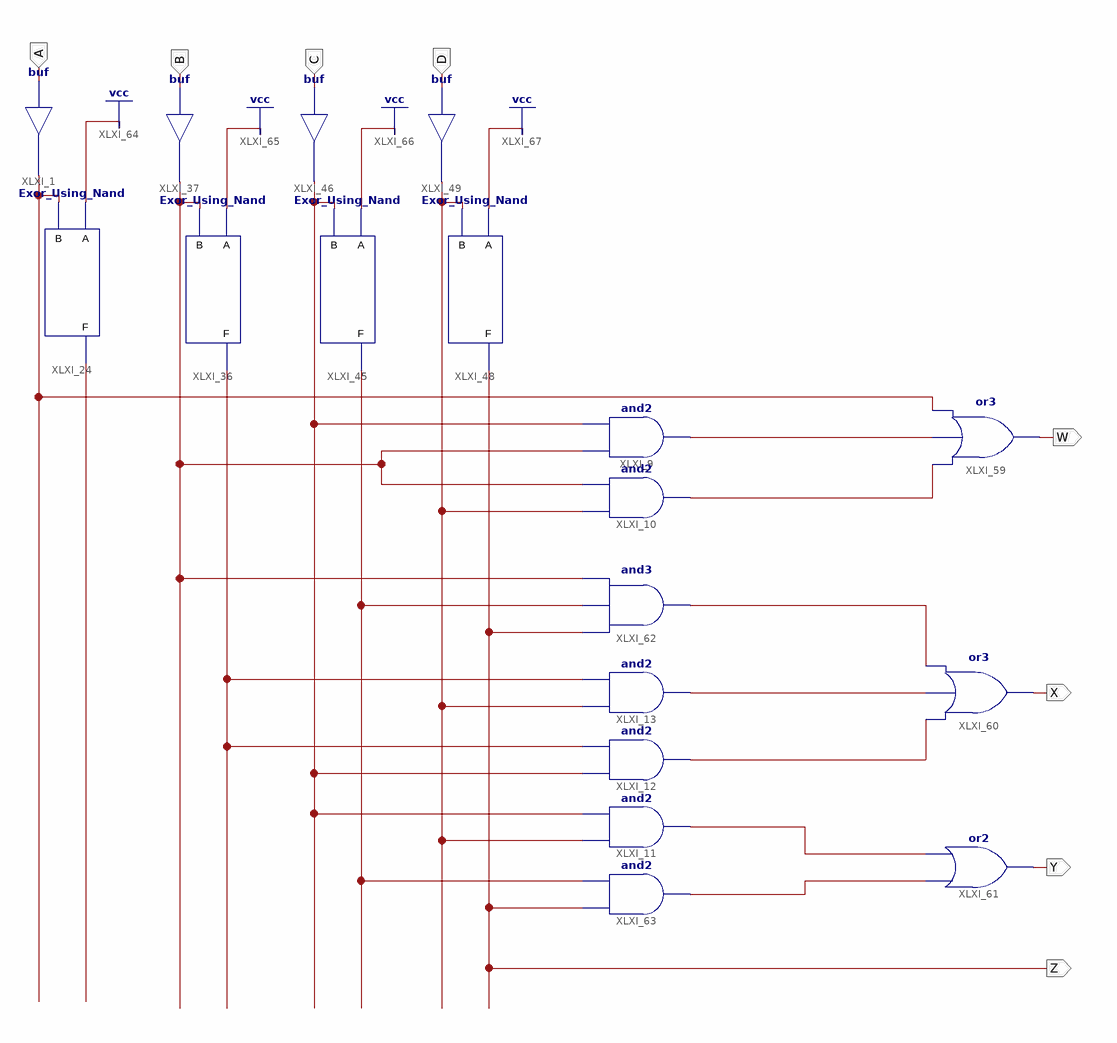
[diagram p0: schematic sheet 1]
// Xilinx ISE schematic Bcd_To_Excess_3_Bcd.sch (spartan3e) as structural Verilog: 18 symbols, 8 ports
module Bcd_To_Excess_3_Bcd (
  input  A,
  input  B,
  input  C,
  input  D,
  output Z,
  output W,
  output X,
  output Y
);

  wire XLXN_22, XLXN_60, XLXN_61, XLXN_63, XLXN_64, XLXN_66, XLXN_82, XLXN_83, XLXN_84, XLXN_94, XLXN_95,
       XLXN_96, XLXN_98, XLXN_99;

  Exor_Using_Nand XLXI_24 (.A(1'b1), .B(XLXN_82), .F(XLXN_22));
  buf XLXI_1 (XLXN_82, A);
  and XLXI_9 (XLXN_83, XLXN_60, XLXN_63);
  and XLXI_10 (XLXN_84, XLXN_66, XLXN_60);
  and XLXI_11 (XLXN_98, XLXN_66, XLXN_63);
  and XLXI_12 (XLXN_96, XLXN_63, XLXN_61);
  and XLXI_13 (XLXN_95, XLXN_66, XLXN_61);
  buf XLXI_37 (XLXN_60, B);
  Exor_Using_Nand XLXI_36 (.A(1'b1), .B(XLXN_60), .F(XLXN_61));
  Exor_Using_Nand XLXI_45 (.A(1'b1), .B(XLXN_63), .F(XLXN_64));
  buf XLXI_46 (XLXN_63, C);
  Exor_Using_Nand XLXI_48 (.A(1'b1), .B(XLXN_66), .F(Z));
  buf XLXI_49 (XLXN_66, D);
  or XLXI_59 (W, XLXN_84, XLXN_83, XLXN_82);
  or XLXI_60 (X, XLXN_96, XLXN_95, XLXN_94);
  or XLXI_61 (Y, XLXN_99, XLXN_98);
  and XLXI_62 (XLXN_94, Z, XLXN_64, XLXN_60);
  and XLXI_63 (XLXN_99, Z, XLXN_64);
endmodule
